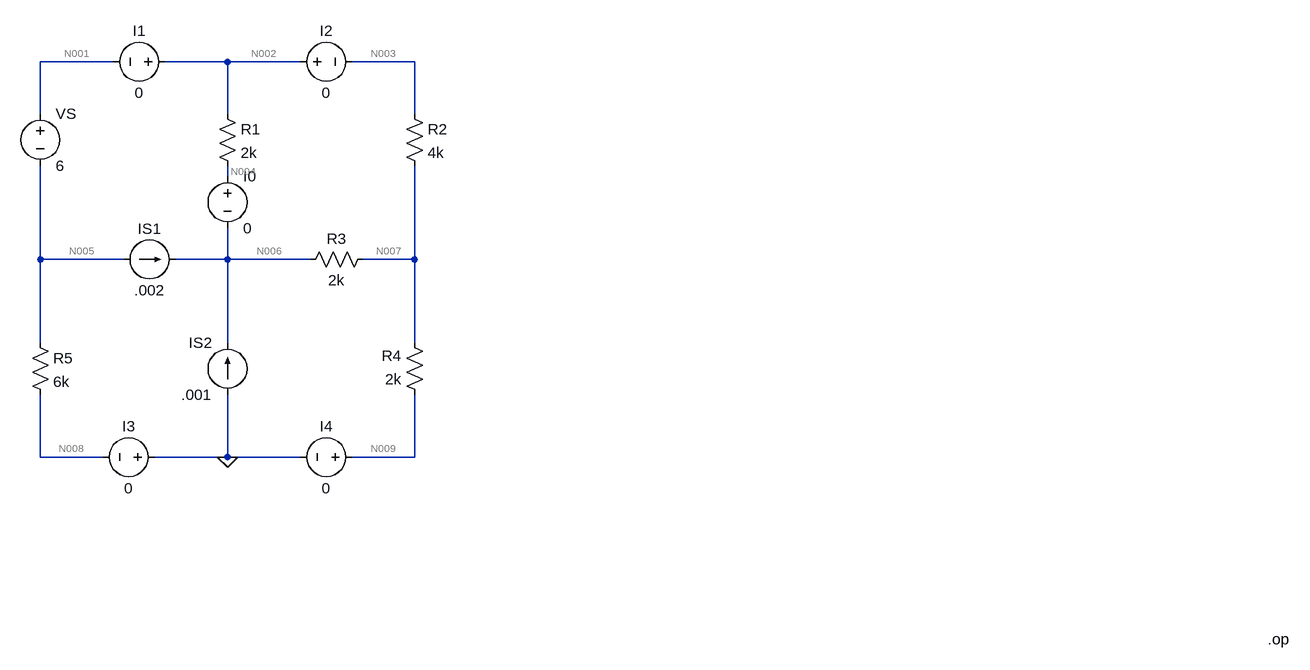
[diagram p0: schematic HW3P03.asc]
HW3P03.asc, the LTspice schematic file:
Version 4
SHEET 1 1928 904
WIRE 112 0 0 0
WIRE 288 0 192 0
WIRE 400 0 288 0
WIRE 576 0 480 0
WIRE 0 80 0 0
WIRE 288 80 288 0
WIRE 576 80 576 0
WIRE 288 176 288 160
WIRE 0 304 0 160
WIRE 128 304 0 304
WIRE 288 304 288 256
WIRE 288 304 208 304
WIRE 416 304 288 304
WIRE 576 304 576 160
WIRE 576 304 496 304
WIRE 0 432 0 304
WIRE 288 432 288 304
WIRE 576 432 576 304
WIRE 0 608 0 512
WIRE 96 608 0 608
WIRE 288 608 288 512
WIRE 288 608 176 608
WIRE 400 608 288 608
WIRE 576 608 576 512
WIRE 576 608 480 608
FLAG 288 608 0
SYMBOL voltage 0 64 R0
SYMATTR InstName VS
SYMATTR Value 6
SYMBOL res 272 64 R0
SYMATTR InstName R1
SYMATTR Value 2k
SYMBOL res 560 64 R0
SYMATTR InstName R2
SYMATTR Value 4k
SYMBOL res 512 288 R90
WINDOW 0 0 56 VBottom 2
WINDOW 3 32 56 VTop 2
SYMATTR InstName R3
SYMATTR Value 2k
SYMBOL res 592 528 R180
WINDOW 0 36 76 Left 2
WINDOW 3 36 40 Left 2
SYMATTR InstName R4
SYMATTR Value 2k
SYMBOL res -16 416 R0
SYMATTR InstName R5
SYMATTR Value 6k
SYMBOL current 128 304 R270
WINDOW 0 32 40 VTop 2
WINDOW 3 -32 40 VBottom 2
SYMATTR InstName IS1
SYMATTR Value .002
SYMBOL current 288 512 R180
WINDOW 0 24 80 Left 2
WINDOW 3 24 0 Left 2
SYMATTR InstName IS2
SYMATTR Value .001
SYMBOL voltage 208 0 R90
WINDOW 0 -32 56 VBottom 2
WINDOW 3 32 56 VTop 2
SYMATTR InstName I1
SYMATTR Value 0
SYMBOL voltage 384 0 R270
WINDOW 0 32 56 VTop 2
WINDOW 3 -32 56 VBottom 2
SYMATTR InstName I2
SYMATTR Value 0
SYMBOL voltage 192 608 R90
WINDOW 0 -32 56 VBottom 2
WINDOW 3 32 56 VTop 2
SYMATTR InstName I3
SYMATTR Value 0
SYMBOL voltage 496 608 R90
WINDOW 0 -32 56 VBottom 2
WINDOW 3 32 56 VTop 2
SYMATTR InstName I4
SYMATTR Value 0
SYMBOL voltage 288 160 R0
SYMATTR InstName I0
SYMATTR Value 0
TEXT 1888 888 Left 2 !.op

The netlist it stands for:
* HW3P03.asc
VS N001 N005 6
R1 N002 N004 2k
R2 N003 N007 4k
R3 N007 N006 2k
R4 N009 N007 2k
R5 N005 N008 6k
IS1 N005 N006 .002
IS2 0 N006 .001
V§I1 N002 N001 0
V§I2 N002 N003 0
V§I3 0 N008 0
V§I4 N009 0 0
V§I0 N004 N006 0
.op
.backanno
.end

* Results of the author's LTspice run, read from the files saved beside the schematic
* Operating Point:
*   V(n001) = 3 V
*   V(n005) = -3 V
*   V(n002) = 3 V
*   V(n004) = 6 V
*   V(n003) = 3 V
*   V(n007) = 3 V
*   V(n006) = 6 V
*   V(n009) = 0 V
*   V(n008) = 0 V
*   I(Is1) = 2 mA
*   I(Is2) = 1 mA
*   I(R1) = -1.5 mA
*   I(R2) = 0 A
*   I(R3) = -1.5 mA
*   I(R4) = -1.5 mA
*   I(R5) = -500 µA
*   I(Vs) = 1.5 mA
*   I(I1) = 1.5 mA
*   I(I2) = 0 A
*   I(I3) = 500 µA
*   I(I4) = 1.5 mA
*   I(I0) = -1.5 mA